# Altium schematic sheet W5500.SchDoc
size A4
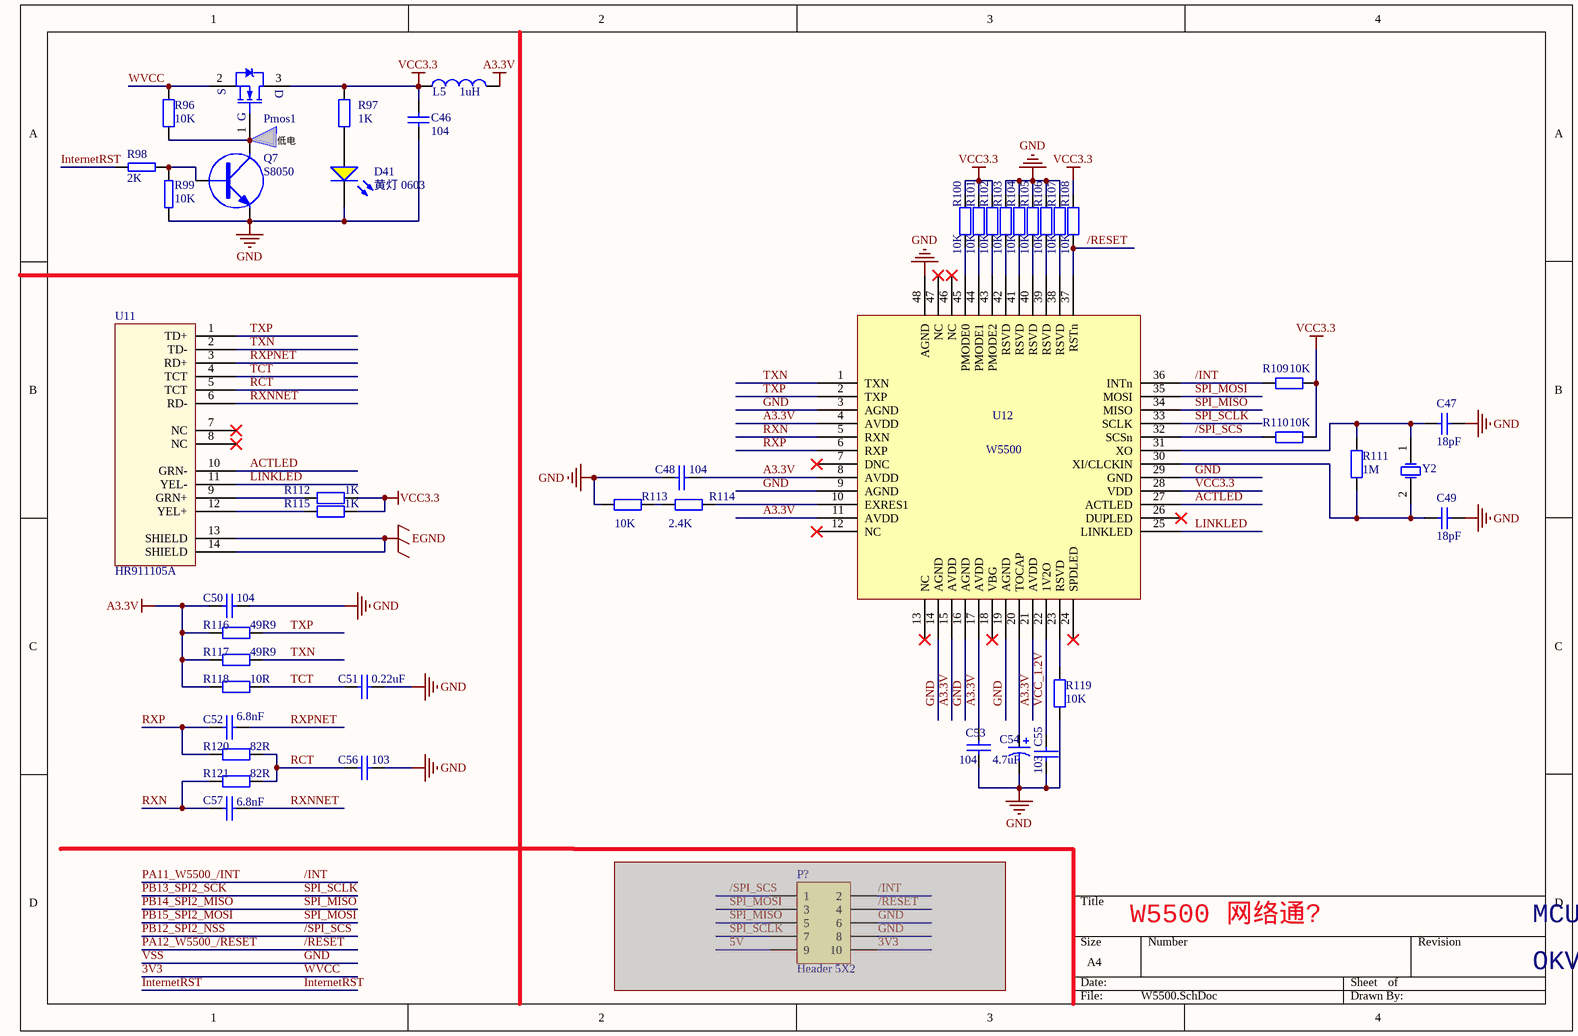
[diagram p0: W5500.SchDoc]

## Parts
C46  104  [LC-0603_C]
C47  18pF  [LC-0603_C]
C48  104  [LC-0603_C]
C49  18pF  [LC-0603_C]
C50  104  [LC-0603_C]
C51  0.22uF  [LC-0603_C]
C52  6.8nF  [LC-0603_C]
C53  104  [LC-0603_C]
C54  4.7uF  [LC-CASE-R_2012]
C55  103  [LC-0603_C]
C56  103  [LC-0603_C]
C57  6.8nF  [LC-0603_C]
D41  黄灯 0603  [LC-0603_LED_S1]
L5  1uH  [LC-0805_L]
P?  Header 5X2  [F2.54-2*5]  (masked out: inside a compile mask, not in the netlist)
Pmos1  SI2301  [LC-SOT-23(SOT-23-3)]  (value not drawn)
Q7  S8050  [LC-SOT-23(SOT-23-3)]
R96  10K  [LC-0603_R]
R97  1K  [LC-0603_R]
R98  2K  [LC-0603_R]
R99  10K  [LC-0603_R]
R100  10K  [LC-0603_R]
R101  10K  [LC-0603_R]
R102  10K  [LC-0603_R]
R103  10K  [LC-0603_R]
R104  10K  [LC-0603_R]
R105  10K  [LC-0603_R]
R106  10K  [LC-0603_R]
R107  10K  [LC-0603_R]
R108  10K  [LC-0603_R]
R109  10K  [LC-0603_R]
R110  10K  [LC-0603_R]
R111  1M  [LC-0603_R]
R112  1K  [LC-0603_R]
R113  10K  [LC-0603_R]
R114  2.4K  [LC-0603_R]
R115  1K  [LC-0603_R]
R116  49R9  [LC-0603_R]
R117  49R9  [LC-0603_R]
R118  10R  [LC-0603_R]
R119  10K  [LC-0603_R]
R120  82R  [LC-0603_R]
R121  82R  [LC-0603_R]
U11  HR911105A  [HR911105A]
U12  W5500  [LQFP48]
Y2  25MHz  [LC-HC-49SMD]  (value not drawn)

## Nets
A3.3V: C48.2 C50.2 C53.1 L5.2 R116.1 R117.1 R118.1 U12.4(AVDD) U12.8(AVDD) U12.11(AVDD) U12.15(AVDD) U12.17(AVDD) U12.21(AVDD)
EGND: U11.13(SHIELD) U11.14(SHIELD)
GND: C46.1 C47.1 C48.1 C49.1 C50.1 C51.2 C53.2 C54.2 C55.2 C56.1 D41.K Q7.2 R99.1 R103.1 R104.1 R105.1 R106.1 R107.1 R113.2 R119.2 U12.3(AGND) U12.9(AGND) U12.14(AGND) U12.16(AGND) U12.19(AGND) U12.29(GND) U12.48(AGND)  [also labelled VSS]
VCC3.3: C46.2 L5.1 Pmos1.3(D) R97.2 R100.1 R101.1 R102.1 R108.1 R109.1 R110.1 R112.2 R115.2 U12.28(VDD)
3V3: Pmos1.2(S) R96.2  [also labelled WVCC]
/INT: R109.2 U12.36(INTn)  [also labelled PA11_W5500_/INT]
/RESET: R108.2 U12.37(RSTn)  [also labelled PA12_W5500_/RESET]
/SPI_SCS: R110.2 U12.32(SCSn)  [also labelled PB12_SPI2_NSS]
ACTLED: U11.10(GRN-) U12.27(ACTLED)
InternetRST: R98.2
LINKLED: U11.11(YEL-) U12.25(LINKLED)
PB13_SPI2_SCK: U12.33(SCLK)  [also labelled SPI_SCLK]
PB14_SPI2_MISO: U12.34(MISO)  [also labelled SPI_MISO]
PB15_SPI2_MOSI: U12.35(MOSI)  [also labelled SPI_MOSI]
RCT: C56.2 R120.2 R121.2 U11.5(TCT)
RXN: C57.1 R121.1 U12.5(RXN)
RXNNET: C57.2 U11.6(RD-)
RXP: C52.1 R120.1 U12.6(RXP)
RXPNET: C52.2 U11.3(RD+)
TCT: C51.1 R118.2 U11.4(TCT)
TXN: R117.2 U11.2(TD-) U12.1(TXN)
TXP: R116.2 U11.1(TD+) U12.2(TXP)
VCC_1.2V: C55.1 U12.22(1V2O)
NetC47_2: C47.2 R111.2 U12.31(XO) Y2.1(OSC1)
NetC49_2: C49.2 R111.1 U12.30(XI/CLCKIN) Y2.2(OSC2)
NetC54_1: C54.1 U12.20(TOCAP)
NetD41_A: D41.A R97.1
NetPmos1_1: Pmos1.1(G) Q7.3 R96.1
NetQ7_1: Q7.1 R98.1 R99.2
NetR100_2: R100.2 U12.45(PMODE0)
NetR101_2: R101.2 U12.44(PMODE1)
NetR102_2: R102.2 U12.43(PMODE2)
NetR103_2: R103.2 U12.42(RSVD)
NetR104_2: R104.2 U12.41(RSVD)
NetR105_2: R105.2 U12.40(RSVD)
NetR106_2: R106.2 U12.39(RSVD)
NetR107_2: R107.2 U12.38(RSVD)
NetR112_1: R112.1 U11.9(GRN+)
NetR113_1: R113.1 R114.2
NetR114_1: R114.1 U12.10(EXRES1)
NetR115_1: R115.1 U11.12(YEL+)
NetR119_1: R119.1 U12.23(RSVD)

Not connected (* = marked no-connect by the designer): U11 7(NC)* 8(NC)*; U12 7(DNC)* 12(NC)* 13(NC)* 18(VBG)* 24(SPDLED)* 26(DUPLED)* 46(NC)* 47(NC)*

## Notes on the sheet
- 低电
- W5500 网络通?
- MCU板
- OKV0.0.0

## Library data of the parts
C46 C47 C49 = Cap: Capacitor; Published: 8-Jun-2000; LatestRevisionDate: 17-Jul-2002; LatestRevisionNote: Re-released for DXP Platform.; PackageReference: RAD-0.3; Publisher: Altium Limited
  C46: Value: 104
  C47 C49: Value: 18pF
C48 C50-C53 C55-C57 = CAP: Capacitor
C54 = Cap Pol3: Polarized Capacitor (Surface Mount); Published: 8-Jun-2000; LatestRevisionDate: 17-Jul-2002; LatestRevisionNote: Re-released for DXP Platform.; PackageReference: C0805; Publisher: Altium Limited; Value: 4.7uF
D41 = 0: 发光二极管; ComponentLink1Description: 供应商链接; ComponentLink1URL: http://www.szlcsc.com/product/details_73147.html; Package: 0603; Supplier: LC; SuppliersPartNumber: C72038
L5 = Inductor: Code_IEC: 1005; Published: 8-Jun-2000; LatestRevisionDate: 17-Jul-2002; LatestRevisionNote: Re-released for DXP Platform.; PackageReference: 0402-A; Publisher: Altium Limited; Code_JEITA: 0402; Value: 1uH
P? = Header 5X2: Header, 5-Pin, Dual row; LatestRevisionDate: 17-Jul-2002; LatestRevisionNote: Re-released for DXP Platform.; Publisher: Altium Limited
Pmos1 = N-M
Q7 = NPN
R96 R97 R100-R112 R115 R118-R121 = Res2: Resistor; Published: 8-Jun-2000; LatestRevisionDate: 17-Jul-2002; LatestRevisionNote: Re-released for DXP Platform.; PackageReference: AXIAL-0.4; Publisher: Altium Limited
  R96 R100-R110 R119: Value: 10K
  R97 R112 R115: Value: 1K
  R111: Value: 1M
  R118: Value: 10R
  R120 R121: Value: 82R
R98 R99 = RES
R113 R114 = Res2: Resistor; Value: 12.4K 1%; Published: 8-Jun-2000; LatestRevisionDate: 17-Jul-2002; LatestRevisionNote: Re-released for DXP Platform.; PackageReference: AXIAL-0.4; Publisher: Altium Limited
R116 R117 = Res2: Resistor; Value: 49.9R; Published: 8-Jun-2000; LatestRevisionDate: 17-Jul-2002; LatestRevisionNote: Re-released for DXP Platform.; PackageReference: AXIAL-0.4; Publisher: Altium Limited
U12 = W5500: W5500以太网芯片
Y2 = XTAL: Crystal Oscillator; Published: 8-Jun-2000; LatestRevisionDate: 17-Jul-2002; LatestRevisionNote: Re-released for DXP Platform.; PackageReference: R38; Publisher: Altium Limited